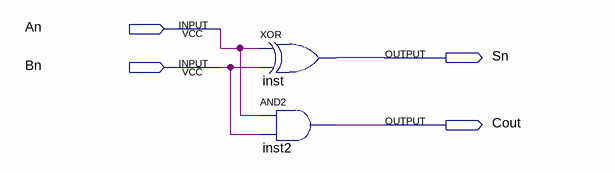
[diagram p0: schematic sheet]
// Quartus schematic Half_Adder.bdf as structural Verilog: 2 symbols, 4 pins
module Half_Adder (
  input  An,
  input  Bn,
  output Sn,
  output Cout
);

  xor inst (Sn, An, Bn);
  and inst2 (Cout, An, Bn);
endmodule
